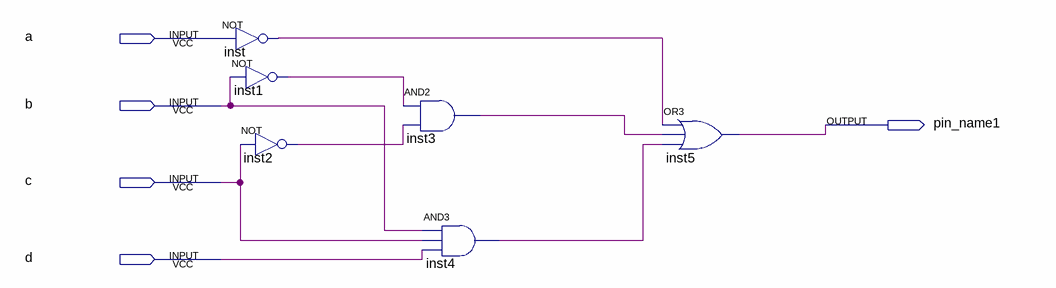
[diagram p0: schematic sheet]
// Quartus schematic decod1-3.bdf as structural Verilog: 6 symbols, 5 pins
module \decod1-3  (
  input  a,
  input  b,
  input  c,
  input  d,
  output pin_name1
);

  wire inst1_out, inst2_out, inst3_out, inst4_out, inst_out;

  not inst (inst_out, a);
  not inst1 (inst1_out, b);
  not inst2 (inst2_out, c);
  and inst3 (inst3_out, inst1_out, inst2_out);
  and inst4 (inst4_out, b, c, d);
  or inst5 (pin_name1, inst_out, inst3_out, inst4_out);
endmodule
